# EAGLE design NFCUnlocker (EAGLE 9.4.2)
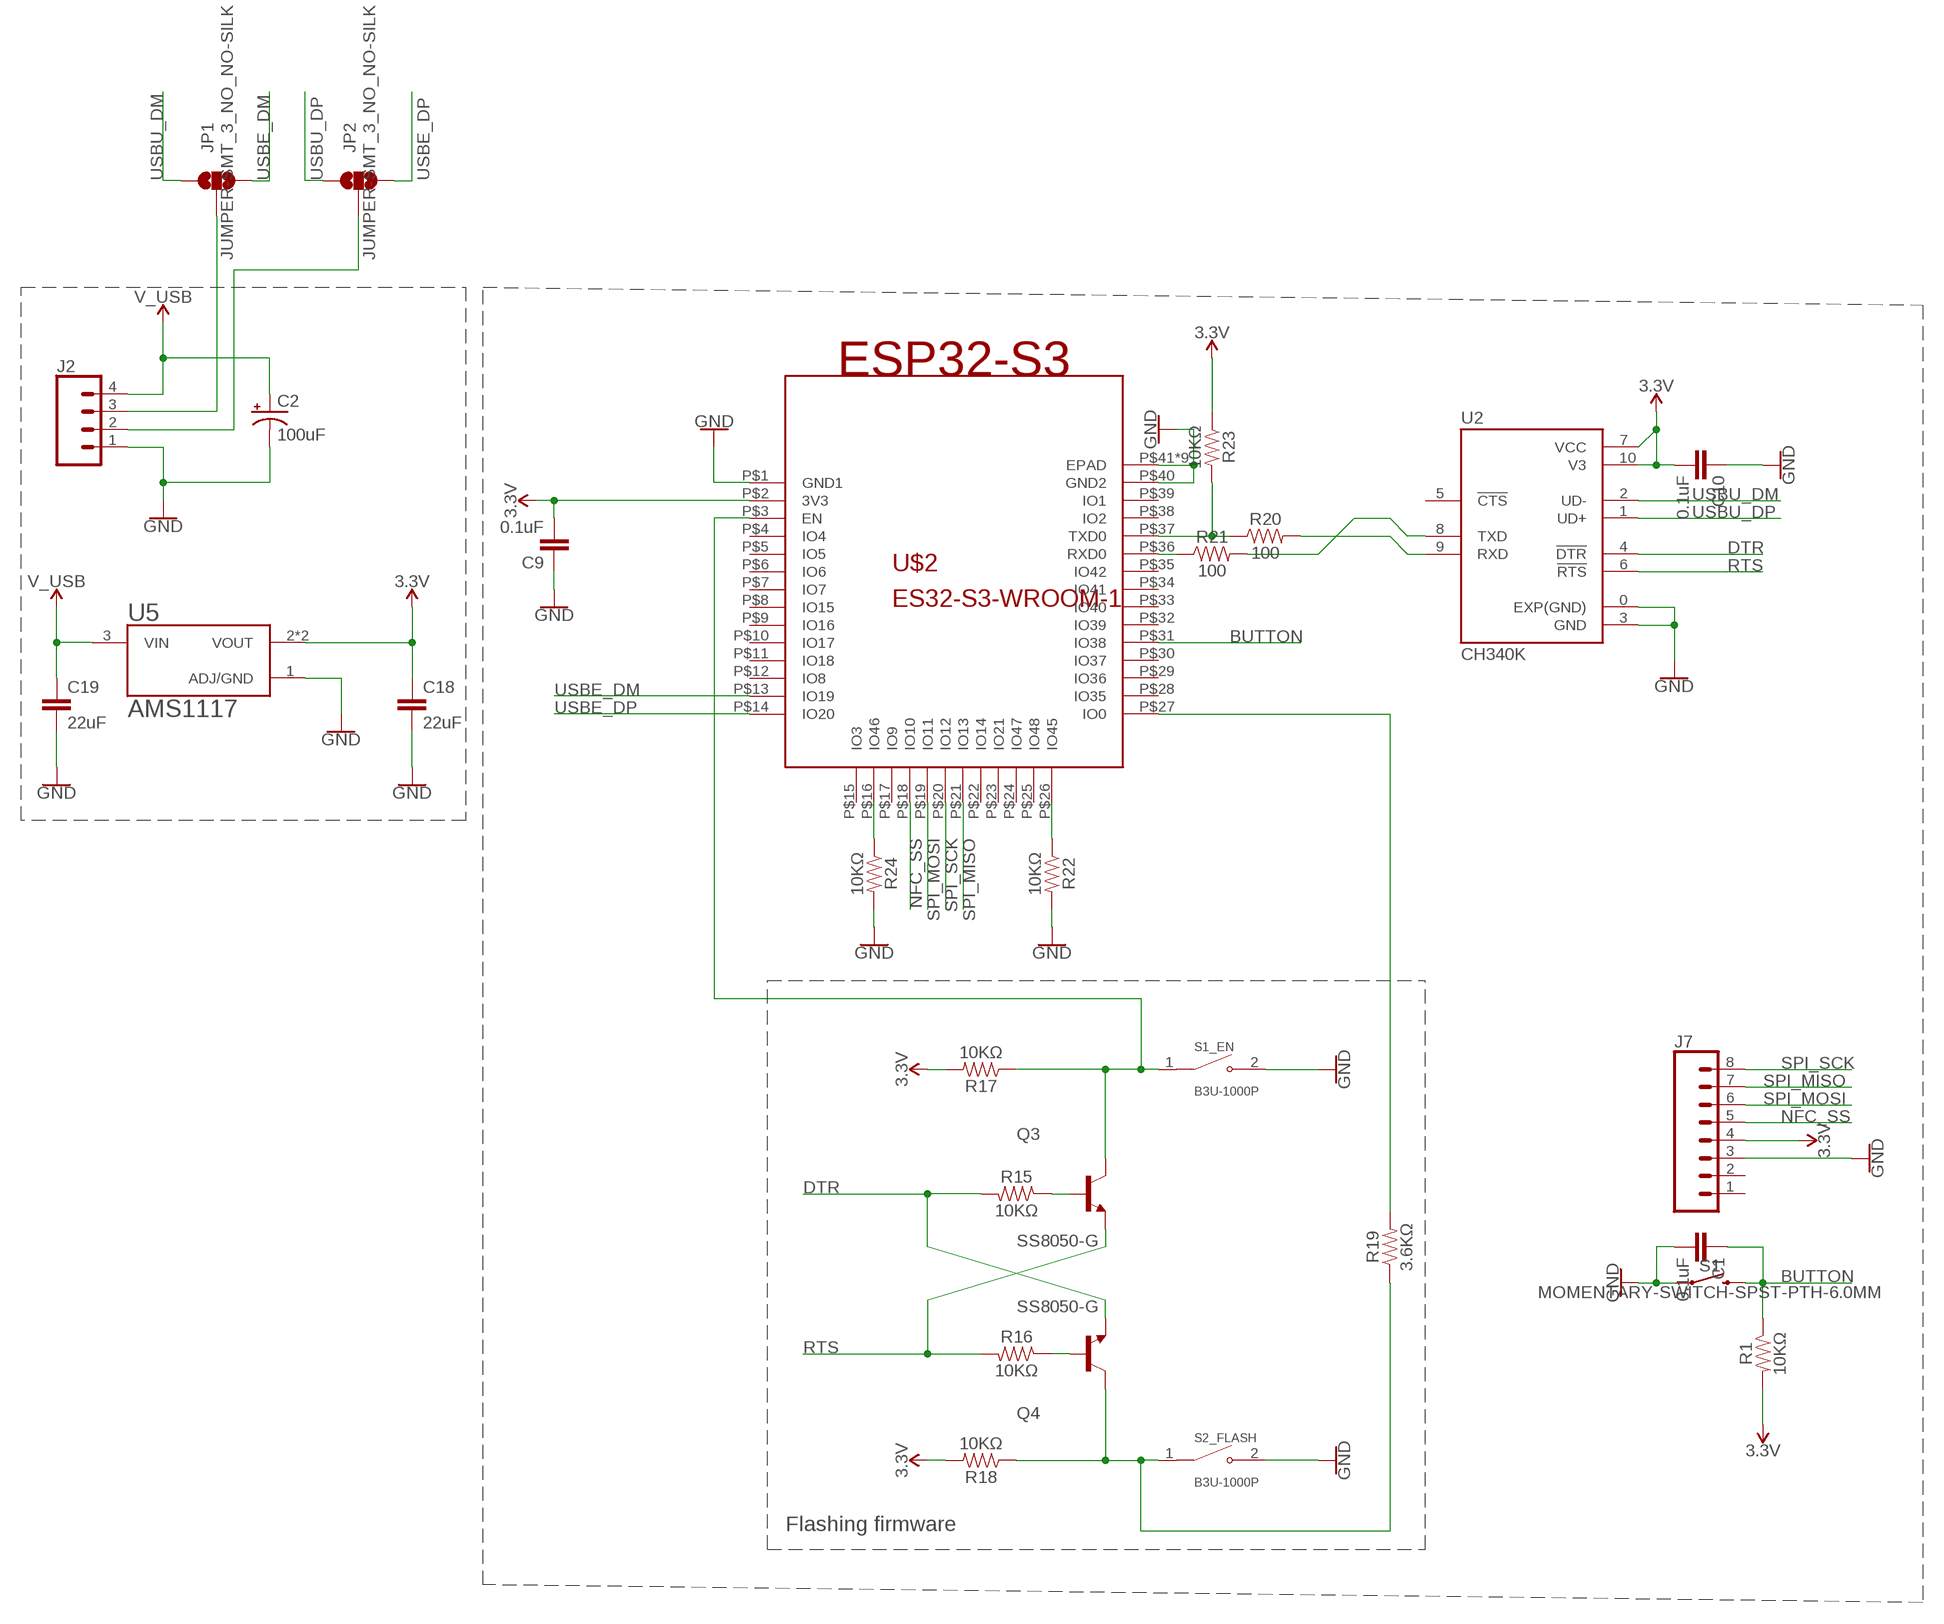
[diagram p0: schematic, sheet 1]

## Parts
C1  0.1uF  0.1UF-0402-6.3V-10%-X7R  [0402]
C2  100uF  100UF-POLAR-RADIAL-2.5MM-25V-20%  [CPOL-RADIAL-2.5MM-6.5MM]
C9  0.1uF  0.1UF-0402-6.3V-10%-X7R  [0402]
C10  0.1uF  0.1UF-0402-6.3V-10%-X7R  [0402]
C18  22uF  22UF-1206-50V-10%  [1206]
C19  22uF  22UF-1206-50V-10%  [1206]
J2  CONN_04LONGPADS  [1X04_LONGPADS]
J7  CONN_08LONGPADS  [1X08_LONGPADS]
JP1  JUMPER-SMT_3_NO_NO-SILK  [SMT-JUMPER_3_NO_NO-SILK]
JP2  JUMPER-SMT_3_NO_NO-SILK  [SMT-JUMPER_3_NO_NO-SILK]
Q3  SS8050-G  [TRANS_SS8050-G]
Q4  SS8050-G  [TRANS_SS8050-G]
R1  10KΩ  10KOHM-0402T-1/16W-1%  [0402-TIGHT]
R15  10KΩ  10KOHM-0402T-1/16W-1%  [0402-TIGHT]
R16  10KΩ  10KOHM-0402T-1/16W-1%  [0402-TIGHT]
R17  10KΩ  10KOHM-0402T-1/16W-1%  [0402-TIGHT]
R18  10KΩ  10KOHM-0402T-1/16W-1%  [0402-TIGHT]
R19  3.6KΩ  10KOHM-0402T-1/16W-1%  [0402-TIGHT]
R20  100  100OHM-0402-TIGHT-1/16W-1%  [0402-TIGHT]
R21  100  100OHM-0402-TIGHT-1/16W-1%  [0402-TIGHT]
R22  10KΩ  10KOHM-0402T-1/16W-1%  [0402-TIGHT]
R23  10KΩ  10KOHM-0402T-1/16W-1%  [0402-TIGHT]
R24  10KΩ  10KOHM-0402T-1/16W-1%  [0402-TIGHT]
S1  MOMENTARY-SWITCH-SPST-PTH-6.0MM  [TACTILE_SWITCH_PTH_6.0MM]
S1_EN  B3U-1000P  [SW_B3U-1000P]
S2_FLASH  B3U-1000P  [SW_B3U-1000P]
U2  CH340K  [SOP100P600X160-11N]
U5  AMS1117  [SOT229P700X180-4N]
U$2  ES32-S3-WROOM-1  [ESP32-S3-WROOM-1]

## Nets
3.3V: C9.2 C10.2 C18.1 J7.4 R1.2 R17.2 R18.2 R23.1 U2.7(VCC) U2.10(V3) U5.2(VOUT) U5.4(VOUT) U$2.P$2(3V3)
BUTTON: C1.1 R1.1 S1.3 U$2.P$31(IO38)
DTR: Q4.2(E) R15.2 U2.4(!DTR)
GND: C1.2 C2.2(-) C9.1 C10.1 C18.2 C19.2 J2.1 J7.3 R22.2 R24.2 S1.1 S1_EN.2 S2_FLASH.2 U2.0(EXP(GND)) U2.3(GND) U5.1(ADJ/GND) U$2.P$1(GND1) U$2.P$40(GND2) U$2.P$41(EPAD) U$2.P$42(EPAD) U$2.P$43(EPAD) U$2.P$44(EPAD) U$2.P$45(EPAD) U$2.P$46(EPAD) U$2.P$47(EPAD) U$2.P$48(EPAD) U$2.P$49(EPAD)
N$1: J2.3 JP1.2
N$2: J2.2 JP2.2
N$26: R20.2 U2.9(RXD)
N$27: R21.2 U2.8(TXD)
N$29: R20.1 R23.2 U$2.P$37(TXD0)
N$30: R21.1 U$2.P$36(RXD0)
N$31: Q4.1(B) R16.1
N$32: Q3.1(B) R15.1
N$33: R19.2 U$2.P$27(IO0)
N$34: Q3.3(C) R17.1 S1_EN.1 U$2.P$3(EN)
N$35: Q4.3(C) R18.1 R19.1 S2_FLASH.1
N$36: R24.1 U$2.P$16(IO46)
N$37: R22.1 U$2.P$26(IO45)
NFC_SS: J7.5 U$2.P$18(IO10)
RTS: Q3.2(E) R16.2 U2.6(!RTS)
SPI_MISO: J7.7 U$2.P$21(IO13)
SPI_MOSI: J7.6 U$2.P$19(IO11)
SPI_SCK: J7.8 U$2.P$20(IO12)
USBE_DM: JP1.3 U$2.P$13(IO19)
USBE_DP: JP2.3 U$2.P$14(IO20)
USBU_DM: JP1.1 U2.2(UD-)
USBU_DP: JP2.1 U2.1(UD+)
V_USB: C2.1(+) C19.1 J2.4 U5.3(VIN)
Unconnected: J7.1 J7.2 U2.5(!CTS) U$2.P$4(IO4) U$2.P$5(IO5) U$2.P$6(IO6) U$2.P$7(IO7) U$2.P$8(IO15) U$2.P$9(IO16) U$2.P$10(IO17) U$2.P$11(IO18) U$2.P$12(IO8) U$2.P$15(IO3) U$2.P$17(IO9) U$2.P$22(IO14) U$2.P$23(IO21) U$2.P$24(IO47) U$2.P$25(IO48) U$2.P$28(IO35) U$2.P$29(IO36) U$2.P$30(IO37) U$2.P$32(IO39) U$2.P$33(IO40) U$2.P$34(IO41) U$2.P$35(IO42) U$2.P$38(IO2) U$2.P$39(IO1)

## Notes on the sheet
- Flashing firmware

## Library data of the parts
C1 C9 C10 = SparkFun-Capacitors:0.1UF: 0.1µF ceramic capacitors A capacitor is a passive two-terminal electrical component used to store electrical energy temporarily in an electric field.; PROD_ID: CAP-14993
C2 = SparkFun-Capacitors:100UF-POLAR: 100µF polarized capacitors A capacitor is a passive two-terminal electrical component used to store electrical energy temporarily in an electric field.; PROD_ID: CAP-08439
C18 C19 = SparkFun-Capacitors:22UF: 22µF ceramic capacitors A capacitor is a passive two-terminal electrical component used to store electrical energy temporarily in an electric field.; PROD_ID: CAP-15263
J2 = SparkFun-Connectors-Old:CONN_04: Multi connection point. Often used as Generic Header-pin footprint for 0.1 inch spaced/style header connections On any of the 0.1 inch spaced packages, you can populate with these: Break Away Headers - Straight <https://www.sparkfun.com/products/116> (PRT-00116) Break Away Male Headers - Right Angle <https://www.sparkfun.com/products/553> (PRT-00553) Female Headers <https://www.sparkfun.com/products/115> (PRT-00115) Break Away Headers - Machine Pin <https://www.sparkfun.com/products/117> (PRT-00117) Break Away Female Headers - Swiss Machine Pin <https://www.sparkfun.com/products/743> (PRT-00743) For SCREWTERMINALS and SPRING TERMINALS visit here: Screw Terimnals on SparkFun.com <https://www.sparkfun.com/search/results?term=Screw+Terminals> (5mm/3.5mm/2.54mm spacing) This device is also useful as a general connection point to wire up your design to another part of your project. Our various solder wires solder well into these plated through hole pads. Hook-Up Wire - Assortment (Stranded, 22 AWG) <https://www.sparkfun.com/products/11375> (PRT-11375) Hook-Up Wire - Assortment (Solid Core, 22 AWG) <https://www.sparkfun.com/products/11367> (PRT-11367) View the entire wire category on our website here <https://www.sparkfun.com/categories/141> Special notes: Molex polarized connector foot print use with SKU : PRT-08231 with associated crimp pins and housings. 1MM SMD Version SKU: PRT-10208; PROD_ID: CONN-09696
J7 = SparkFun-Connectors:CONN_08: Multi connection point. Often used as Generic Header-pin footprint for 0.1 inch spaced/style header connections On any of the 0.1 inch spaced packages, you can populate with these: Break Away Headers - Straight <https://www.sparkfun.com/products/116> (PRT-00116) Break Away Male Headers - Right Angle <https://www.sparkfun.com/products/553> (PRT-00553) Female Headers <https://www.sparkfun.com/products/115> (PRT-00115) Break Away Headers - Machine Pin <https://www.sparkfun.com/products/117> (PRT-00117) Break Away Female Headers - Swiss Machine Pin <https://www.sparkfun.com/products/743> (PRT-00743) Arduino Stackable Header - 8 Pin <https://www.sparkfun.com/products/9279> (PRT-09279) For SCREWTERMINALS and SPRING TERMINALS visit here: Screw Terimnals on SparkFun.com <https://www.sparkfun.com/search/results?term=Screw+Terminals> (5mm/3.5mm/2.54mm spacing) This device is also useful as a general connection point to wire up your design to another part of your project. Our various solder wires solder well into these plated through hole pads. Hook-Up Wire - Assortment (Stranded, 22 AWG) <https://www.sparkfun.com/products/11375> (PRT-11375) Hook-Up Wire - Assortment (Solid Core, 22 AWG) <https://www.sparkfun.com/products/11367> (PRT-11367) View the entire wire category on our website here <https://www.sparkfun.com/categories/141> Special notes: Molex polarized connector foot print use with SKU : PRT-08231 with associated crimp pins and housings. 1MM SMD Version SKU: PRT-10208 NOTES ON THE VARIANTS LOCK and LOCK_LONGPADS... This footprint was designed to help hold the alignment of a through-hole component (i.e. 6-pin header) while soldering it into place. You may notice that each hole has been shifted either up or down by 0.005 of an inch from it's more standard position (which is a perfectly straight line). This slight alteration caused the pins (the squares in the middle) to touch the edges of the holes. Because they are alternating, it causes a "brace" to hold the component in place. 0.005 has proven to be the perfect amount of "off-center" position when using our standard breakaway headers. Although looks a little odd when you look at the bare footprint, once you have a header in there, the alteration is very hard to notice. Also,if you push a header all the way into place, it is covered up entirely on the bottom side.
JP1 JP2 = SparkFun-Jumpers:JUMPER-SMT_3_NO: Normally open jumper This jumper has three pads in close proximity to each other. Apply solder to close the connection(s).
Q3 Q4 = SS8050-G:SS8050-G: Bipolar (BJT) Transistor NPN 25 V 1.5 A 100MHz 300 mW Surface Mount SOT-23-3 Check availability <https://pricing.snapeda.com/parts/SS8050-G/Comchip%20Technology/view-part?ref=eda>; AVAILABILITY: In Stock; DESCRIPTION: Bipolar (BJT) Transistor NPN 25 V 1.5 A 100MHz 300 mW Surface Mount SOT-23-3; MF: Comchip Technology; MP: SS8050-G; PACKAGE: TO-236-3 Comchip Technology; PCBWAY_MPN: SS8050-G; PRICE: None; PURCHASE-URL: https://pricing.snapeda.com/search/part/SS8050-G/?ref=eda
R1 R15-R18 R22-R24 = SparkFun-Resistors:10KOHM: 10kΩ resistor A resistor is a passive two-terminal electrical component that implements electrical resistance as a circuit element. Resistors act to reduce current flow, and, at the same time, act to lower voltage levels within circuits. - Wikipedia; PCBWAY_MPN: RC0402JR-0710KL; PROD_ID: RES-14241; VALUE: 10k
R19 = SparkFun-Resistors:10KOHM: 10kΩ resistor A resistor is a passive two-terminal electrical component that implements electrical resistance as a circuit element. Resistors act to reduce current flow, and, at the same time, act to lower voltage levels within circuits. - Wikipedia; PCBWAY_MPN: RC0402FR-073K6L; PROD_ID: RES-14241; VALUE: 10k
R20 R21 = SparkFun-Resistors:100OHM: 100Ω resistor A resistor is a passive two-terminal electrical component that implements electrical resistance as a circuit element. Resistors act to reduce current flow, and, at the same time, act to lower voltage levels within circuits. - Wikipedia; PROD_ID: RES-14962
S1 = SparkFun-Switches:MOMENTARY-SWITCH-SPST: Momentary Switch (Pushbutton) - SPST Normally-open (NO) SPST momentary switches (buttons, pushbuttons). Variants PTH-12MM - 12mm square, through-hole Momentary Pushbutton Switch - 12mm Square <https://www.sparkfun.com/products/9190> (COM-09190) PTH-6.0MM, PTH-6.0MM-KIT - 6.0mm square, through-hole Mini Pushbutton Switch <https://www.sparkfun.com/products/97> (COM-00097) KIT package intended for soldering kit's - only one side of pads' copper is exposed. PTH-RIGHT-ANGLE-KIT - Right-angle, through-hole Right Angle Tactile Button <https://www.sparkfun.com/products/10791> - Used on SparkFun BigTime Watch Kit <https://www.sparkfun.com/products/11734> SMD-12MM - 12mm square, surface-mount Tactile Button - SMD (12mm) <https://www.sparkfun.com/products/12993> (COM-12993) Used on SparkFun PicoBoard <https://www.sparkfun.com/products/11888> SMD-4.5MM - 4.5mm Square Trackball Switch Used on SparkFun Blackberry Trackballer Breakout <https://www.sparkfun.com/products/13169> SMD-4.6MMX2.8MM - 4.60mm x 2.80mm, surface mount Used on SparkFun Pro Micro - RP2040 <https://www.sparkfun.com/products/17717> SMD-5.2MM, SMD-5.2-REDUNDANT - 5.2mm square, surface-mount Mini Pushbutton Switch - SMD <https://www.sparkfun.com/products/8720> (COM-08720) Used on Arduino Pro Mini <https://www.sparkfun.com/products/11114> REDUNDANT package connects both switch circuits together SMD-6.0X3.5MM - 6.0 x 3.5mm, surface mount Momentary Reset Switch SMD <https://www.sparkfun.com/products/8229> (COM-08229) SMD-6.2MM-TALL - 6.2mm square, surface mount Tactile Button - SMD (6mm) <https://www.sparkfun.com/products/12992> Used on SparkFun Digital Sandbox <https://www.sparkfun.com/products/12651> SMD-RIGHT-ANGLE - Right-angle, surface mount Used on SparkFun Block for Intel® Edison - Arduino <https://www.sparkfun.com/products/13036>; PROD_ID: SWCH-08441; SF_SKU: COM-00097
S1_EN S2_FLASH = B3U-1000P:B3U-1000P: Switch Tactile N.O. SPST Round Button Gull Wing 0.05A 12VDC 1.5N SMD Embossed T/R Check availability <https://pricing.snapeda.com/parts/B3U-1000P/Omron/view-part?ref=eda>; AVAILABILITY: In Stock; DESCRIPTION: Tactile Switch SPST-NO Top Actuated Surface Mount; MF: Omron; MP: B3U-1000P; PACKAGE: Custom Package Omron; PCBWAY_MPN: B3U-1000P; PRICE: None; PURCHASE-URL: https://pricing.snapeda.com/search/part/B3U-1000P/?ref=eda
U2 = CH340K:CH340K: Check availability <https://pricing.snapeda.com/parts/CH340K/WCH/view-part?ref=eda>; AVAILABILITY: Not in stock; CHECK_PRICES: https://www.snapeda.com/parts/CH340K/WCH/view-part/?ref=eda; DESCRIPTION: USB to Serial Port Chip; MF: WCH; MP: CH340K; PACKAGE: Package; PRICE: None; SNAPEDA_LINK: https://www.snapeda.com/parts/CH340K/WCH/view-part/?ref=snap
U5 = AMS1117:AMS1117: Sot223/Pkg 1-Amp 5-Volt Low Drop Out Voltage Regulatator Check availability <https://pricing.snapeda.com/parts/AMS1117/Advanced%20Monolithic%20Systems/view-part?ref=eda>; AVAILABILITY: Not in stock; DESCRIPTION: 1A LOW DROPOUT VOLTAGE REGULATOR SOT-223; MF: Advanced Monolithic Systems; MP: AMS1117; PACKAGE: SOT-223 Seeed Technology; PRICE: None
U$2 = ESP32 Module:ES32-S3-WROOM-1

## Net classes
0 default: width 0.457 mm, drill 0.508 mm, clearance 0.305 mm

## Board
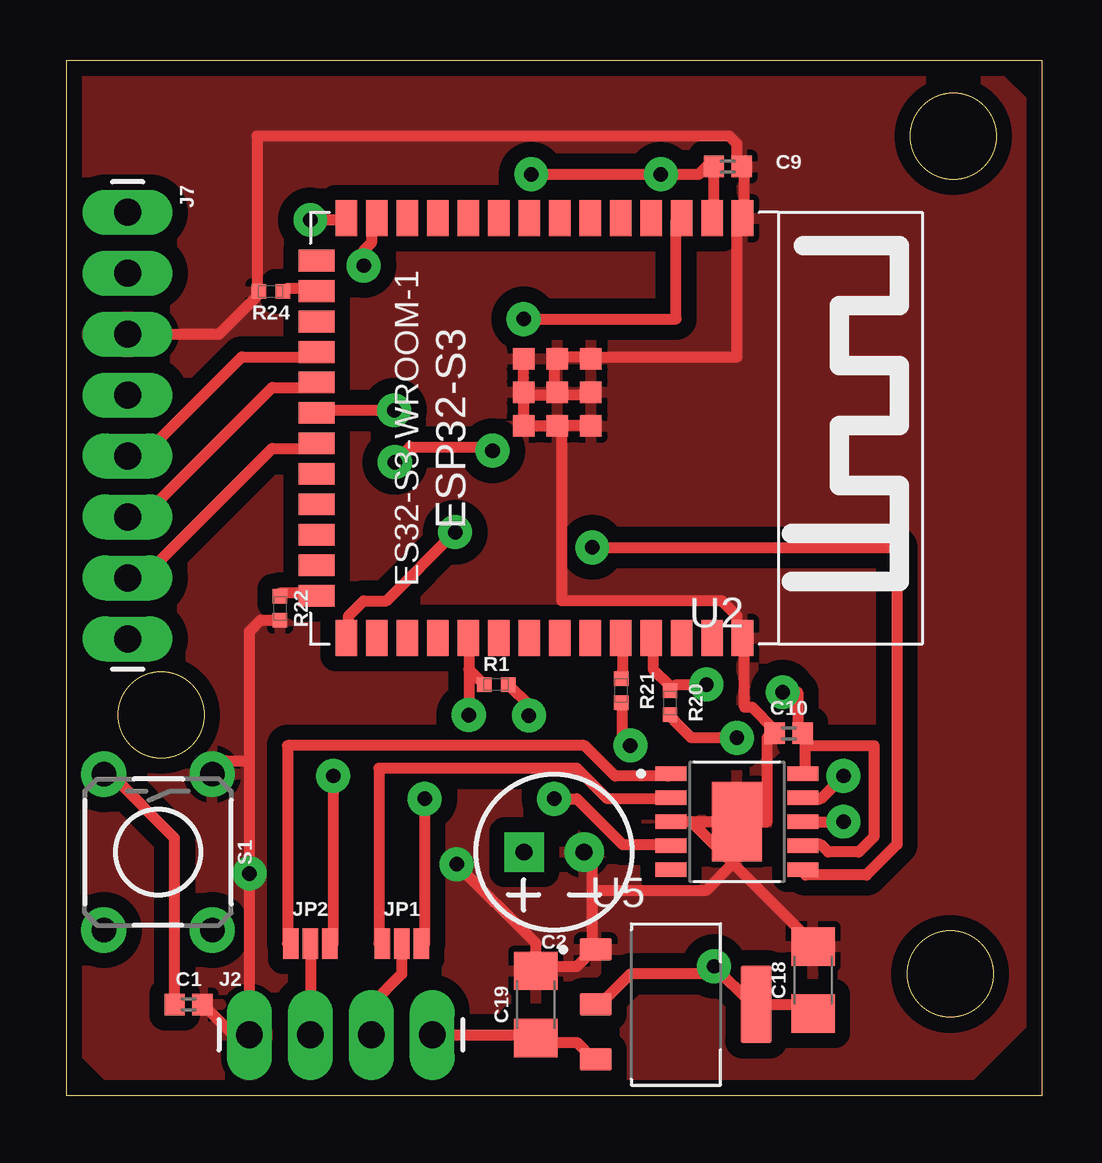
[diagram p1: board, top side]
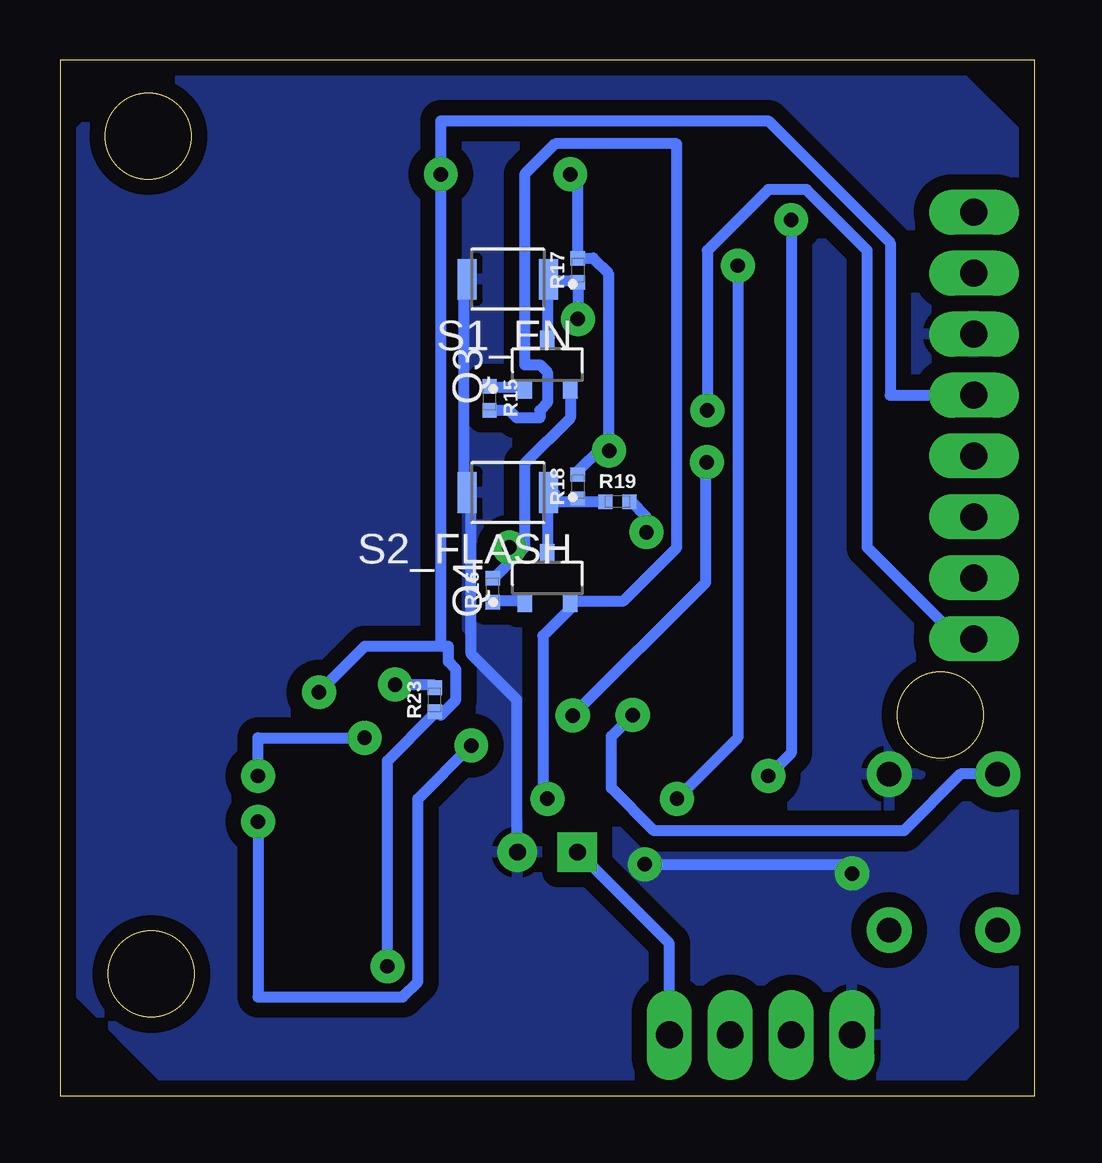
[diagram p2: board, bottom side, seen from below]

Size 40.64 x 43.18 mm. Coordinates in mm from the lower left corner, seen from the top.
Outline: 0,43.18 40.64,43.18 40.64,0 0,0 0,43.18
Outline: circle at 36.83,5.08 radius 1.8
Outline: circle at 3.94,15.88 radius 1.8
Outline: circle at 36.96,40.01 radius 1.8
Copper layers (1*16): Top 0.035mm / dielectric 1.5mm / Bottom 0.035mm
Design rules "default *": minimum track width 6mil, minimum drill 0.6mm, track to track 6mil, track to pad 6mil, pad to pad 6mil, via to via 6mil, smd to smd 6mil, copper to edge 15mil, drill to drill 6mil, minimum pad ring 15mil, minimum via ring 16mil, stop-mask expansion 4mil, vias tented up to drill 40mil, thermal gap 10mil

### Footprints (pad centres in the part's own frame; a part is rotated, then mirrored left to right if it is on the bottom)
0402 = smd 0.85 x 0.9: 1 -0.58,0; 2 0.58,0
CPOL-RADIAL-2.5MM-6.5MM = drill 0.7 pad 1.651 square: 1 1.25,0 | drill 0.7 pad 1.651: 2 -1.25,0
1206 = smd 1.6 x 1.8: 1 -1.4,0; 2 1.4,0
1X04_LONGPADS = drill 1.118 pad 1.88 long: 1 0,0; 2 2.54,0; 3 5.08,0; 4 7.62,0
1X08_LONGPADS = drill 1.118 pad 1.88 long: 1 0,0; 2 2.54,0; 3 5.08,0; 4 7.62,0; 5 10.16,0; 6 12.7,0; 7 15.24,0; 8 17.78,0
SMT-JUMPER_3_NO_NO-SILK = smd 0.635 x 1.27: 1 -0.813,0; 2 0,0; 3 0.813,0
TRANS_SS8050-G = smd 0.8 x 0.6: 1 -1.01,0.95; 2 -1.01,-0.95; 3 1.01,0
0402-TIGHT = smd 0.6 x 0.6: 1 -0.5,0; 2 0.5,0
TACTILE_SWITCH_PTH_6.0MM = drill 1.016 pad 1.88: 1 -3.251,2.261; 2 3.251,2.261; 3 -3.251,-2.261; 4 3.251,-2.261
SW_B3U-1000P = smd 0.8 x 1.7: 1 -1.7,0; 2 1.7,0
SOP100P600X160-11N = smd 2.1 x 3.3: 0 0,0 | smd 1.31 x 0.6: 1 -2.75,2; 2 -2.75,1; 3 -2.75,0; 4 -2.75,-1; 5 -2.75,-2; 6 2.75,-2; 7 2.75,-1; 8 2.75,0; 9 2.75,1; 10 2.75,2
SOT229P700X180-4N = smd 1.31 x 0.93: 1 -3.345,2.29; 2 -3.345,0; 3 -3.345,-2.29 | smd 1.31 x 3.24: 4 3.345,0
ESP32-S3-WROOM-1 = smd 1.5 x 0.9: P$1 0.25,18.01; P$2 0.25,16.74; P$3 0.25,15.47; P$4 0.25,14.2; P$5 0.25,12.93; P$6 0.25,11.66; P$7 0.25,10.39; P$8 0.25,9.12; P$9 0.25,7.85; P$10 0.25,6.58; P$11 0.25,5.31; P$12 0.25,4.04; P$13 0.25,2.77; P$14 0.25,1.5; P$27 17.75,1.5; P$28 17.75,2.77; P$29 17.75,4.04; P$30 17.75,5.31; P$31 17.75,6.58; P$32 17.75,7.85; P$33 17.75,9.12; P$34 17.75,10.39; P$35 17.75,11.66; P$36 17.75,12.93; P$37 17.75,14.2; P$38 17.75,15.47; P$39 17.75,16.74; P$40 17.75,18.01 | smd 0.9 x 1.5: P$15 2.015,0.25; P$16 3.285,0.25; P$17 4.555,0.25; P$18 5.825,0.25; P$19 7.095,0.25; P$20 8.365,0.25; P$21 9.635,0.25; P$22 10.905,0.25; P$23 12.175,0.25; P$24 13.445,0.25; P$25 14.715,0.25; P$26 15.985,0.25 | smd 0.9 x 0.9: P$41 6.1,11.69; P$42 7.5,11.69; P$43 8.9,11.69; P$44 6.1,10.29; P$45 7.5,10.29; P$46 8.9,10.29; P$47 6.1,8.89; P$48 7.5,8.89; P$49 8.9,8.89

### Placement (x,y rotation side)
C1  5.08,3.81 0 top
C2  20.32,10.16 180 top
C9  27.56,38.73 180 top
C10  30.1,15.11 0 top
C18  31.11,4.83 90 top
C19  19.56,3.81 90 top
J2  7.62,2.54 0 top
J7  2.54,36.83 270 top
JP1  13.97,6.35 0 top
JP2  10.16,6.35 0 top
Q3  20.32,30.48 90 bottom
Q4  20.32,21.59 90 bottom
R1  17.91,17.14 0 top
R15  22.73,29.08 270 bottom
R16  22.61,21.08 90 bottom
R17  19.05,34.42 90 bottom
R18  19.05,25.4 90 bottom
R19  17.4,24.77 0 bottom
R20  25.15,16.38 270 top
R21  23.11,16.89 270 top
R22  8.89,20.32 270 top
R23  25.02,16.51 90 bottom
R24  8.51,33.53 180 top
S1  3.81,10.16 270 top
S1_EN  21.97,34.04 180 bottom
S2_FLASH  21.97,25.15 180 bottom
U2  27.94,11.43 0 top
U5  25.4,3.81 0 top
U$2  10.16,36.83 270 top

### Tracks (layer width: path | path; a pad name or v marks a point on that pad's centre or on a via)
3.3V  (via drill 0.6, 0.61 pad 1.3)
  Top 0.457: U$2.P$2 26.99,36.83 C9.2 26.67,38.73 26.35,38.42 v24.76,38.42 v19.37,38.42 | 30.8,14.61 30.8,13.65 U2.10 | 30.8,14.61 30.8,14.92 C10.2 30.48,15.24 30.48,16.83 v29.84,16.83 | 30.8,14.61 33.66,14.61 33.66,10.79 33.02,10.16 31.75,10.16 31.43,10.48 30.8,10.48 U2.7 | U5.2 22.22,3.81 23.49,5.08 26.99,5.08 v26.99,5.4 28.57,3.81 U5.4 30.8,3.81 31.11,3.49 C18.1 | R1.2 19.27,16.29 v19.27,15.85 | v13.68,26.42 14.31,27.05 17.59,27.05 v17.75,26.89
  Bottom 0.457: 18.1,26.99 17.78,27.31 17.78,34.29 18.41,34.92 R17.2 | 18.1,26.99 19.05,26.04 R18.2 | v19.37,38.42 19.05,38.1 R17.2 | R17.2 | v26.99,5.4 26.99,13.97 25.08,15.88 R23.1 24.76,15.88 24.13,16.51 24.13,17.78 24.45,18.1 24.45,18.73 24.76,18.73 | v29.84,16.83 27.94,18.73 24.76,18.73 | J7.4 6.03,29.21 6.03,35.56 11.11,40.64 24.76,40.64 v24.76,38.42 24.76,18.73 | v19.27,15.85 13.72,21.4 13.72,26.42 v13.68,26.42 | v17.75,26.89 17.84,26.99 18.1,26.99
BUTTON  (via drill 0.61 pad 1.3)
  Top 0.457: U$2.P$31 16.76,19.06 16.76,17.78 | 16.76,17.78 v16.76,15.88 | C1.1 4.5,10.74 1.83,13.41 S1.3 | R1.1 16.76,17.78
  Bottom 0.457: S1.3 3.1,13.41 5.46,11.05 15.88,11.05 17.65,12.83 17.65,14.99 v16.76,15.88
DTR  (via drill 0.6)
  Top 0.457: v20.32,12.38 21.27,12.38 23.18,10.48 25.08,10.48 U2.4
  Bottom 0.457: R15.2 22.54,28.57 21.91,28.57 21.59,28.26 20.64,28.26 20.64,28.57 20.32,28.89 20.32,30.16 20.64,30.48 21.27,30.48 21.27,38.42 20,39.69 14.92,39.69 14.92,22.86 17.14,20.64 19.37,20.64 Q4.2 19.37,20.32 20.51,19.18 20.51,12.57 v20.32,12.38
GND  (via drill 0.61 pad 1.3)
  Top 0.457: J7.3 6.35,31.75 7.94,33.34 R24.2 7.94,33.66 7.94,40.01 27.62,40.01 27.94,39.69 27.94,38.73 C9.1 28.26,38.73 28.26,36.83 U$2.P$1 27.94,36.51 27.94,30.8 21.91,30.8 U$2.P$41 21.59,30.8 20.64,30.8 U$2.P$44 20.32,30.48 20.32,29.53 U$2.P$45 | U$2.P$45 20.64,29.21 21.59,29.21 U$2.P$42 | U$2.P$46 20.64,27.94 21.59,27.94 U$2.P$43 | 19.05,29.21 U$2.P$49 | U$2.P$47 U$2.P$48 19.05,29.21 | U$2.P$49 20.32,27.94 U$2.P$46 | U$2.P$49 | 19.05,29.21 20.32,29.21 U$2.P$45 | R22.2 8.07,19.82 7.62,19.37 7.62,13.97 | 7.62,13.97 v7.62,9.27 J2.1 6.93,2.54 C1.2 | 26.04,11.43 U2.0 29.21,11.43 29.21,14.92 C10.1 29.53,15.24 28.57,16.19 28.26,16.19 28.26,19.05 U$2.P$40 27.94,19.37 27.94,20 27.3,20.64 20.64,20.64 20.64,27.62 U$2.P$46 | 26.04,11.43 U2.3 | 26.04,11.43 27.78,9.68 | 27.78,9.68 31.11,6.35 C18.2 | 21.91,8.57 21.91,10.16 C2.2 | 21.91,8.57 21.91,6.35 U5.1 21.91,6.03 21.27,5.4 19.68,5.4 C19.2 19.56,6.35 v16.26,9.65 | 27.78,9.68 26.67,8.57 21.91,8.57 | S1.1 6.63,13.97 7.62,13.97
  Bottom 0.457: S1_EN.2 23.81,33.97 23.81,25.4 S2_FLASH.2 23.49,25.08 23.49,18.42 21.59,16.51 21.59,10.16 C2.2 | v16.26,9.65 8,9.65 v7.62,9.27
  pour Top (isolate 0.635): 0,41.91 1.27,43.18 38.1,43.18 40.64,40.64 40.64,3.81 36.83,0 2.54,0 0,2.54
  pour Bottom (isolate 0.635): 0,39.37 3.81,43.18 36.83,43.18 40.64,39.37 40.64,5.08 35.56,0 3.81,0 0,3.81
N$1
  Top 0.457: JP1.2 13.97,5.08 12.7,3.81 J2.3
N$2
  Top 0.457: JP2.2 J2.2
N$26  (via drill 0.6)
  Top 0.457: v27.94,14.92 26.04,14.92 25.4,15.56 R20.2 | v32.38,13.34 31.43,12.38 30.8,12.38 U2.9
  Bottom 0.457: v27.94,14.92 32.38,14.92 v32.38,13.34
N$27  (via drill 0.6)
  Top 0.457: v23.49,14.61 23.18,14.61 23.18,16.19 R21.2 | U2.8 v32.38,11.43
  Bottom 0.457: v23.49,14.61 25.72,12.38 25.72,4.76 26.35,4.13 32.38,4.13 v32.38,11.43
N$29  (via drill 0.6)
  Top 0.457: v26.67,17.14 25.4,17.14 R20.1 25.08,17.14 24.45,17.78 24.45,19.05 U$2.P$37
  Bottom 0.457: v26.67,17.14 25.08,17.14 R23.2
N$30
  Top 0.457: R21.1 23.18,17.78 23.18,19.05 U$2.P$36
N$31
  Bottom 0.457: R16.1 22.54,20.64 21.27,20.64 Q4.1
N$32
  Bottom 0.457: R15.1 22.54,29.53 21.27,29.53 Q3.1
N$33  (via drill 0.6)
  Top 0.457: v16.19,23.5 13.34,20.64 12.38,20.64 11.75,20 11.75,19.37 U$2.P$27
  Bottom 0.457: v16.19,23.5 16.19,24.13 16.83,24.77 R19.2
N$34  (via drill 0.6)
  Top 0.457: v19.05,32.39 25.4,32.39 25.4,36.51 U$2.P$3
  Bottom 0.457: Q3.3 20.32,33.97 S1_EN.1 20,33.97 19.05,33.97 R17.1 v19.05,32.39
N$35
  Bottom 0.457: 19.05,24.77 R19.1 | Q4.3 20.32,25.08 S2_FLASH.1 20,25.08 20,24.77 19.05,24.77 | 19.05,24.77 R18.1
N$36
  Top 0.457: R24.1 9.21,33.66 10.16,33.66 U$2.P$16
N$37
  Top 0.457: R22.1 8.89,20.96 10.16,20.96 U$2.P$26
NFC_SS
  Top 0.457: J7.5 3.17,26.67 7.3,30.8 10.16,30.8 U$2.P$18
RTS  (via drill 0.6)
  Top 0.457: v21.91,22.86 34.61,22.86 34.61,10.48 33.34,9.21 30.8,9.21 U2.6
  Bottom 0.457: 21.43,22.7 21.27,22.86 21.27,26.35 19.37,28.26 19.37,29.21 Q3.2 | 21.43,22.7 22.54,21.59 R16.2 | v21.91,22.86 21.59,22.86 21.43,22.7
SPI_MISO
  Top 0.457: J7.7 3.17,21.59 8.57,26.99 10.16,26.99 U$2.P$21
SPI_MOSI
  Top 0.457: J7.6 3.17,24.13 8.57,29.53 10.16,29.53 U$2.P$19
SPI_SCK  (via drill 0.6)
  Top 0.457: v13.65,28.57 10.48,28.57 U$2.P$20
  Bottom 0.457: v13.65,28.57 13.65,35.24 11.11,37.78 9.53,37.78 6.98,35.24 6.98,22.86 3.17,19.05 J7.8
USBE_DM  (via drill 0.6)
  Top 0.457: v14.92,12.38 14.92,6.35 JP1.3 | v12.38,34.61 12.38,35.24 12.7,35.56 12.7,36.51 U$2.P$13
  Bottom 0.457: v14.92,12.38 12.38,14.92 v12.38,34.61
USBE_DP  (via drill 0.6)
  Top 0.457: v11.11,13.34 11.11,6.35 JP2.3 | v10.16,36.51 11.43,36.51 U$2.P$14
  Bottom 0.457: v11.11,13.34 10.16,14.29 v10.16,36.51
USBU_DM
  Top 0.457: JP1.1 13.02,6.35 13.02,13.65 21.27,13.65 22.54,12.38 25.08,12.38 U2.2
USBU_DP
  Top 0.457: JP2.1 9.21,6.35 9.21,14.61 21.59,14.61 22.86,13.34 25.08,13.34 U2.1
V_USB
  Top 0.457: U5.3 21.91,1.59 21.27,2.22 19.68,2.22 C19.1 19.37,2.54 J2.4
  Bottom 0.457: J2.4 15.24,6.35 19.05,10.16 C2.1